# Altium schematic sheet PMOD_KYPD.SchDoc
size A4; SheetNumber: 1; SheetTotal: 1
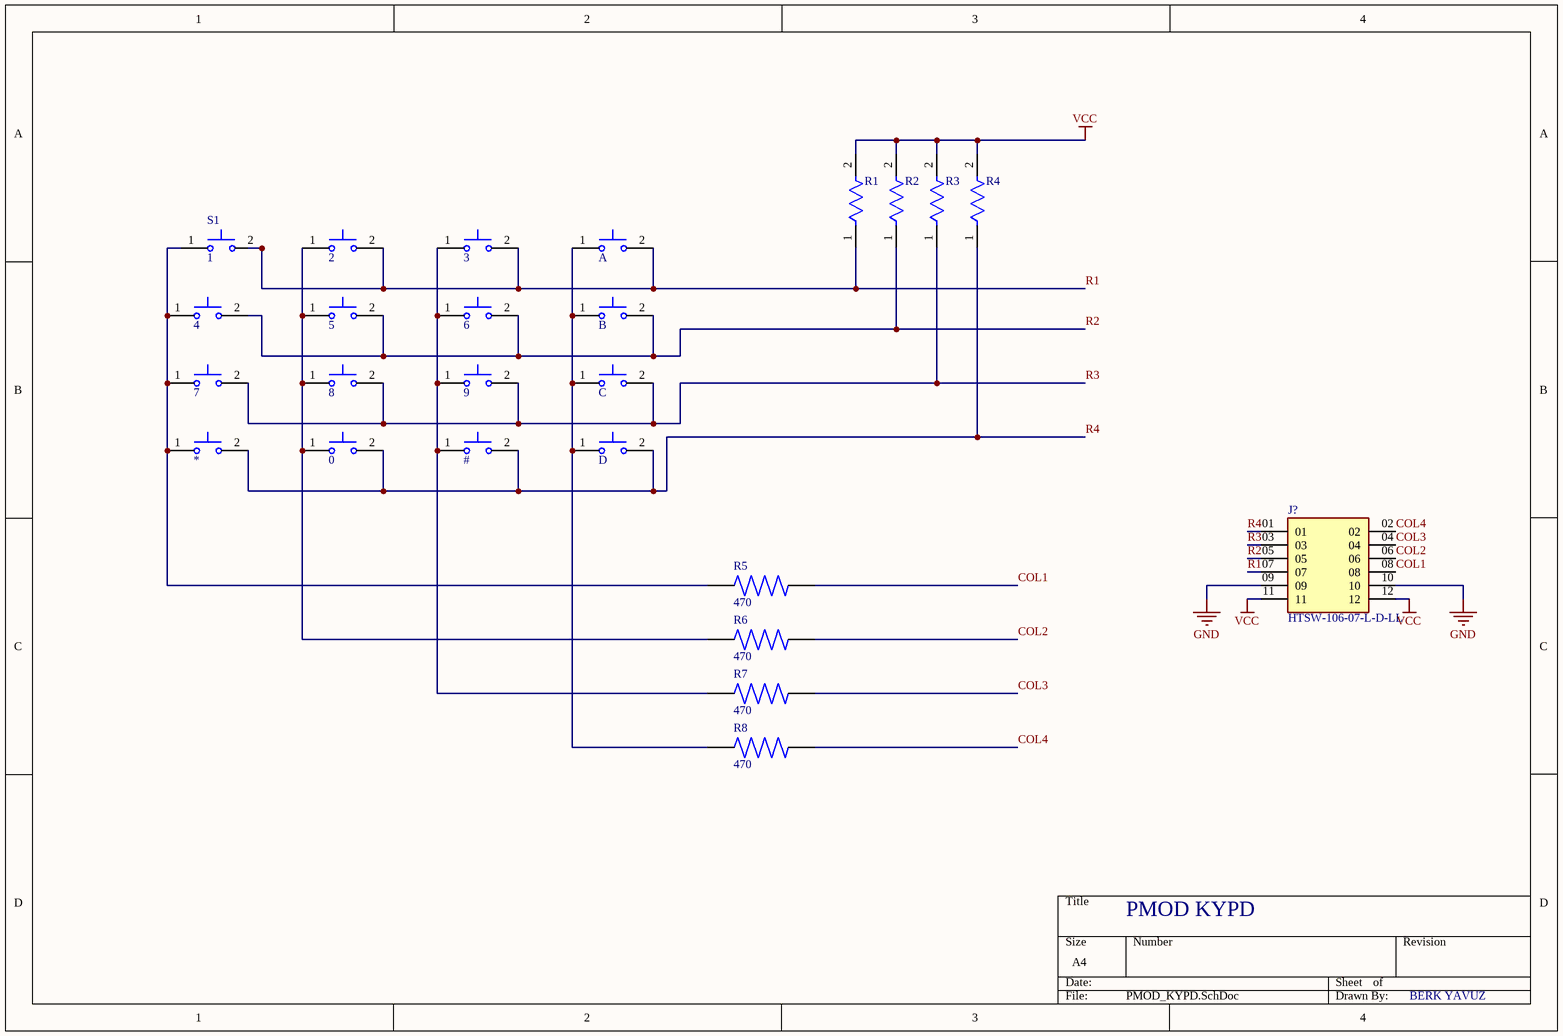
[diagram p0: PMOD_KYPD.SchDoc]

## Parts
J?  HTSW-106-07-L-D-LL  [SAMTEC_HTSW-106-07-L-D-LL]
R1  CRGCQ2512J10K  [FP-CRGCQ2512-IPC_C]  (value not drawn)
R2  CRGCQ2512J10K  [FP-CRGCQ2512-IPC_C]  (value not drawn)
R3  CRGCQ2512J10K  [FP-CRGCQ2512-IPC_C]  (value not drawn)
R4  CRGCQ2512J10K  [FP-CRGCQ2512-IPC_C]  (value not drawn)
R5  470  [RESC6332X70N]
R6  470  [RESC6332X70N]
R7  470  [RESC6332X70N]
R8  470  [RESC6332X70N]
S1  1  [SW_BUTT-2]
S2  2  [SW_BUTT-2]
S3  3  [SW_BUTT-2]
S4  A  [SW_BUTT-2]
S5  4  [SW_BUTT-2]
S6  5  [SW_BUTT-2]
S7  6  [SW_BUTT-2]
S8  B  [SW_BUTT-2]
S9  7  [SW_BUTT-2]
S10  8  [SW_BUTT-2]
S11  9  [SW_BUTT-2]
S12  C  [SW_BUTT-2]
S13  *  [SW_BUTT-2]
S14  0  [SW_BUTT-2]
S15  #  [SW_BUTT-2]
S16  D  [SW_BUTT-2]

## Nets
GND: J?.09 J?.10
VCC: J?.11 J?.12 R1.2 R2.2 R3.2 R4.2
COL1: J?.08 R5.2
COL2: J?.06 R6.2
COL3: J?.04 R7.2
COL4: J?.02 R8.2
R1: J?.07 R1.1 S1.2 S2.2 S3.2 S4.2
R2: J?.05 R2.1 S5.2 S6.2 S7.2 S8.2
R3: J?.03 R3.1 S9.2 S10.2 S11.2 S12.2
R4: J?.01 R4.1 S13.2 S14.2 S15.2 S16.2
NetR5_1: R5.1 S1.1 S5.1 S9.1 S13.1
NetR6_1: R6.1 S2.1 S6.1 S10.1 S14.1
NetR7_1: R7.1 S3.1 S7.1 S11.1 S15.1
NetR8_1: R8.1 S4.1 S8.1 S12.1 S16.1

## Notes on the sheet
- PMOD KYPD
- BERK YAVUZ

## Library data of the parts
J? = HTSW-106-07-L-D-LL: MF: {'manufacturer': u'Samtec'}; Price: None; Value: *; Package: None; Availability: Unavailable; MP: HTSW-106-07-L-D-LL
R1-R4 = CMP-03211-000044-1: CRGCQ2512 10KΩ 1W ±100ppm/°C 5%200V; Manufacturer: TE Connectivity; Tolerance: 0.05; Voltage Rating: 200V; Automotive Grade: Grade 0; Series: CRGCQ; Automotive: Yes; Package: CRGCQ2512; ComponentLink2Description: Datasheet; RoHS: TRUE; Height: 0.65mm; Octopart: https://octopart.com/crgcq2512j10k-te+connectivity-91018617; Value: 10KΩ; Category: Res; Temperature Range High: +155°C; Composition: Thick Film; Device Class L1: Passive Components; Power Rating: 1W; Device Class L2: Resistors; Temperature Coefficient: ±100ppm/°C; Lead Free: Yes; Temperature Range Low: -55°C; Temperature: -55°C to +155°C; ComponentLink2URL: https://www.te.com/commerce/DocumentDelivery/DDEController?Action=showdoc&DocId=Data+Sheet%7F1773204-3%7F1%7Fpdf%7FEnglish%7FENG_DS_1773204-3_1.pdf%7F4-2176349-923; Resistance: 10KΩ; Manufacturer Part Number: CRGCQ2512J10K; Device Class L3: Chip SMD Resistors; Ipc Land Pattern Name: RESC635320X55
R5-R8 = RMCF2512FT470R: MF: {'manufacturer': u'Stackpole Electronics Inc'}; Availability: Unavailable; Value: *; Package: None; Price: None; MP: RMCF2512FT470R
S1-S16 = BUTT-2: Tactile Switches MINI PUSH BUTTON SWITCH 2-PIN QTY. 4; MF: {'manufacturer': u'Gravitech'}; Availability: Unavailable; Price: None; Package: None; Value: *; MP: BUTT-2